# EAGLE design Pupitre (EAGLE 9.5.2)
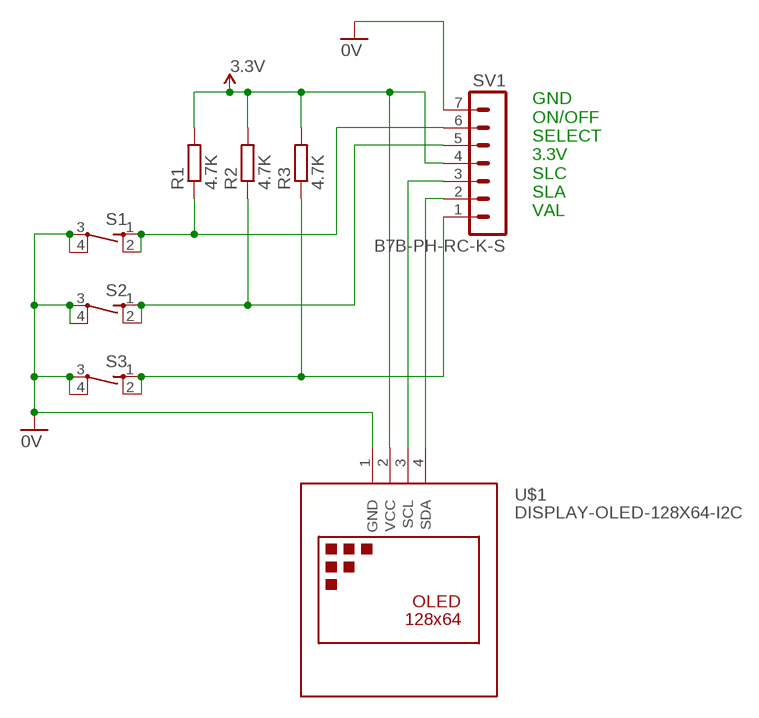
[diagram p0: schematic, sheet 1]

## Parts
R1  4.7K  R-EU_0207/10  [0207/10]
R2  4.7K  R-EU_0207/10  [0207/10]
R3  4.7K  R-EU_0207/10  [0207/10]
S1  SWITCH_10-XX  [SWITCH-10XX]
S2  SWITCH_10-XX  [SWITCH-10XX]
S3  SWITCH_10-XX  [SWITCH-10XX]
SV1  B7B-PH-RC-K-S  [B7B-PH-K-S]
U$1  DISPLAY-OLED-128X64-I2C  [DISPLAY-OLED-128X64-I2C]

## Nets
0V: S1.3(P) S1.4(P1) S2.3(P) S2.4(P1) S3.3(P) S3.4(P1) SV1.7 U$1.1(GND)
N$1: R3.1 S3.1(S) S3.2(S1) SV1.1
N$2: R2.1 S2.1(S) S2.2(S1) SV1.5
N$3: R1.1 S1.1(S) S1.2(S1) SV1.6
N$4: R1.2 R2.2 R3.2 SV1.4 U$1.2(VCC) ; supply symbol labelled 3.3V
N$5: SV1.2 U$1.4(SDA)
N$6: SV1.3 U$1.3(SCL)

## Notes on the sheet
- GND
  ON/OFF
  SELECT
  3.3V
  SLC
  SLA
  VAL

## Library data of the parts
R1-R3 = _Remy:R-EU_: RESISTOR, European symbol
S1-S3 = 00-LIVIO:SWITCH_10-XX: OMRON SWITCH
SV1 = 04_Remy:B7B-PH-RC: JST PH series header 2.00mm pitch disconnectable crimp style connectors, vertical (side entry type), 7 pins
U$1 = arduino_etc:DISPLAY-OLED-128X64-I2C: 128x64 Dot Matrix OLED Module based on SSD1306 chip Variant with I2C interface More details available here: http://www.instructables.com/id/Monochrome-096-i2c-OLED-display-with-arduino-SSD13/ SSD1306 datasheet: https://cdn-shop.adafruit.com/datasheets/SSD1306.pdf Click here to find device on ebay.com <http://www.ebay.com/sch/oled+display+128x64+iic> Note: There are two variants: I2C and SPI. Search for the proper version.

## Board
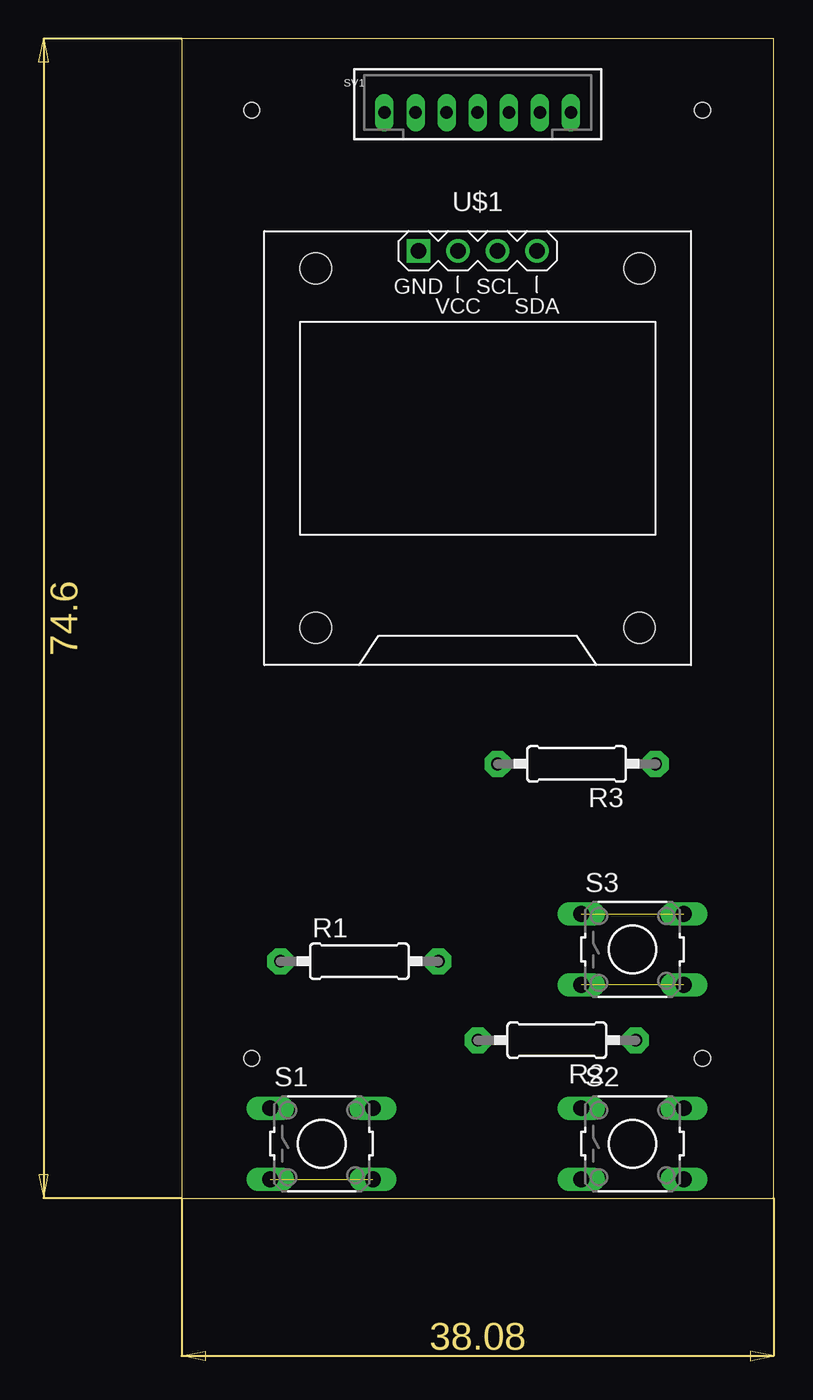
[diagram p1: board, top side]
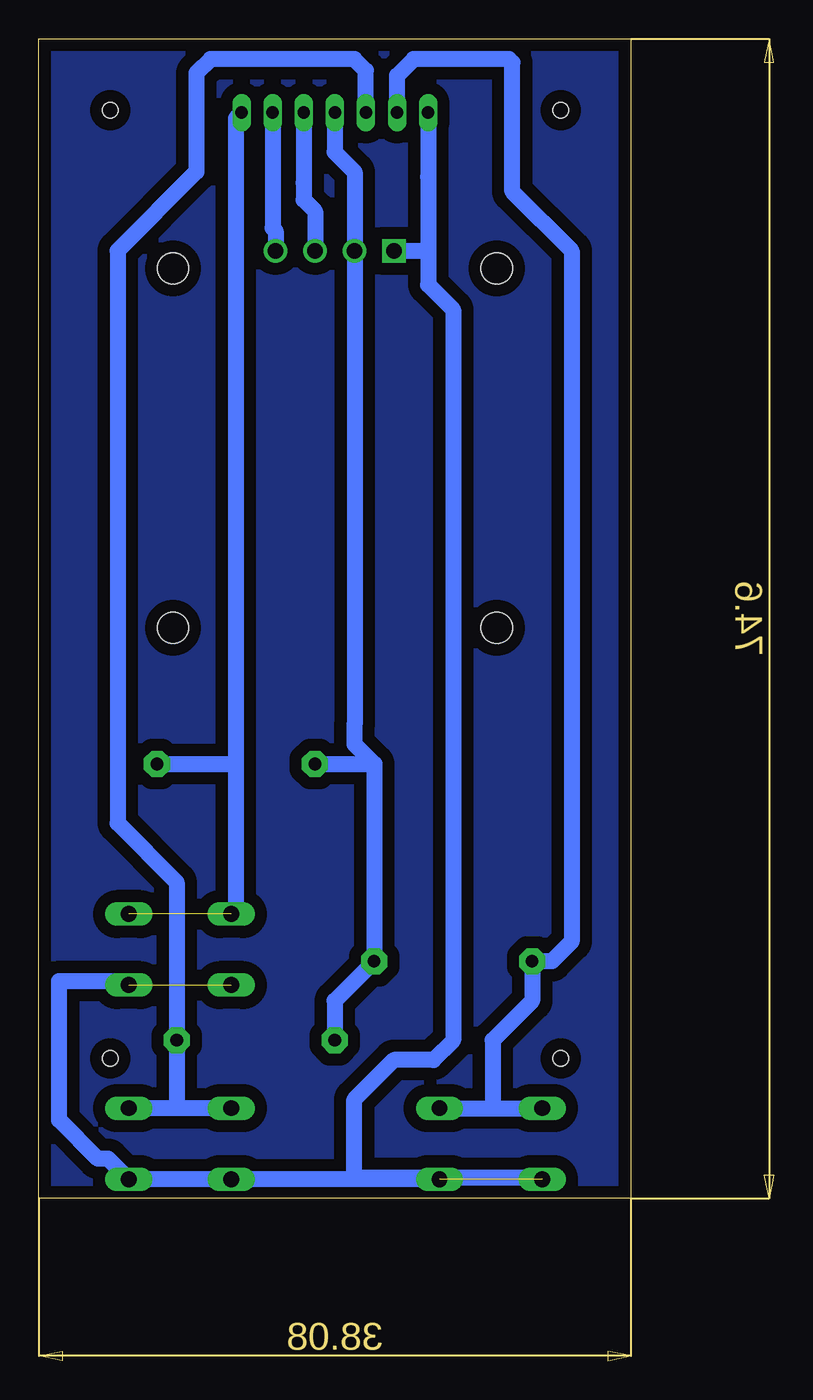
[diagram p2: board, bottom side, seen from below]

Size 38.08 x 74.6 mm. Coordinates in mm from the lower left corner, seen from the top.
Outline: 0,0 38.08,0 38.08,74.6 0,74.6 0,0
Copper layers (1*16): Top 0.035mm / dielectric 0.15mm / Bottom 0.035mm
Design rules "FastGcode-DesignRules": minimum track width 6mil, minimum drill 31mil, track to track 31mil, track to pad 31mil, pad to pad 31mil, via to via 31mil, smd to smd 31mil, copper to edge 31mil, drill to drill 6mil, minimum pad ring 5mil, minimum via ring 8mil, stop-mask expansion 4mil, vias tented up to drill 0mil, thermal gap 165mil
Holes 1 mm at 4.5,9 33.5,9 4.5,70 33.5,70

### Footprints (pad centres in the part's own frame; a part is rotated, then mirrored left to right if it is on the bottom)
0207/10 = drill 0.813 pad 1.676 octagon: 1 -5.08,0; 2 5.08,0
SWITCH-10XX = drill 1.016 long: 1 -3.302,2.286; 2 3.302,2.286; 3 -3.302,-2.286; 4 3.302,-2.286
B7B-PH-K-S = drill 0.8 pad 1.016 long: 1 6,0; 2 4,0; 3 2,0; 4 0,0; 5 -2,0; 6 -4,0; 7 -6,0
DISPLAY-OLED-128X64-I2C = drill 1 square: 1 -3.81,12.7 | drill 1: 2 -1.27,12.7; 3 1.27,12.7; 4 3.81,12.7 | hole 2: -10.414,11.557; 10.414,11.557; 10.414,-11.557; -10.414,-11.557

### Placement (x,y rotation side)
R1  11.43,15.24 0 top
R2  24.13,10.16 180 top
R3  25.4,27.94 180 top
S1  9,3.5 0 top
S2  29,3.5 0 top
S3  29,16 0 top
SV1  19.04,69.85 0 top
U$1  19.04,48.26 0 top

### Tracks (layer width: path | path; a pad name or v marks a point on that pad's centre or on a via)
0V  (2 unrouted)
  Bottom 1.016: S1.3 5.78,1.29 17.78,1.29 17.78,6.35 15.24,8.89 12.7,8.89 11.43,10.16 11.43,57.16 13.04,58.77 13.04,60.96 | S1.4 S2.3 S2.4 33.63,2.54 34.29,2.54 36.78,5.04 36.78,13.97 31.75,13.97 32.01,13.71 S3.4 | 13.04,65.7 SV1.7 13.04,60.96 | U$1.1 13.04,60.96
_OUTLINES_
  pour Bottom (isolate 0.2, rank 6): 0,0 38.08,0 38.08,74.6 0,74.6
N$1  (1 unrouted)
  Bottom 1.016: R3.1 25.4,27.94 | S3.1 25.4,18.58 25.4,27.94 | SV1.1 25.4,69.49 25.4,27.94
N$2
  Bottom 1.016: S2.1 29.21,5.79 | 29.21,5.79 S2.2 | 29.21,5.79 R2.1 29.21,20.32 33.02,24.13 33.02,60.96 27.94,66.04 27.94,72.39 27.02,73.31 17.78,73.31 17.04,72.56 SV1.5
N$3
  Bottom 1.016: S1.2 8.89,5.79 | 8.89,5.79 S1.1 | 8.89,5.79 8.89,10.16 6.35,12.7 R1.1 5.08,15.24 3.81,16.51 3.81,60.96 7.62,64.77 7.62,73.08 7.85,73.31 13.97,73.31 15.04,72.23 SV1.6
N$4
  Bottom 1.016: R2.2 19.05,12.7 R1.2 16.5,27.94 16.51,27.94 | R3.2 16.51,27.94 | SV1.4 19.05,67.31 17.77,66.03 U$1.2 17.77,30.49 17.78,30.48 17.78,29.21 16.51,27.94
N$5
  Bottom 1.016: U$1.4 22.85,62.23 23.04,62.42 SV1.2
N$6
  Bottom 1.016: U$1.3 20.31,63.5 21.05,64.24 21.05,65.31 21.04,65.32 SV1.3